# Altium schematic sheet 控制板.SchDoc
size A2; Author: Dolphi; DrawnBy: Dolphi; : 空调控制器继电器版; Revision: 4.0
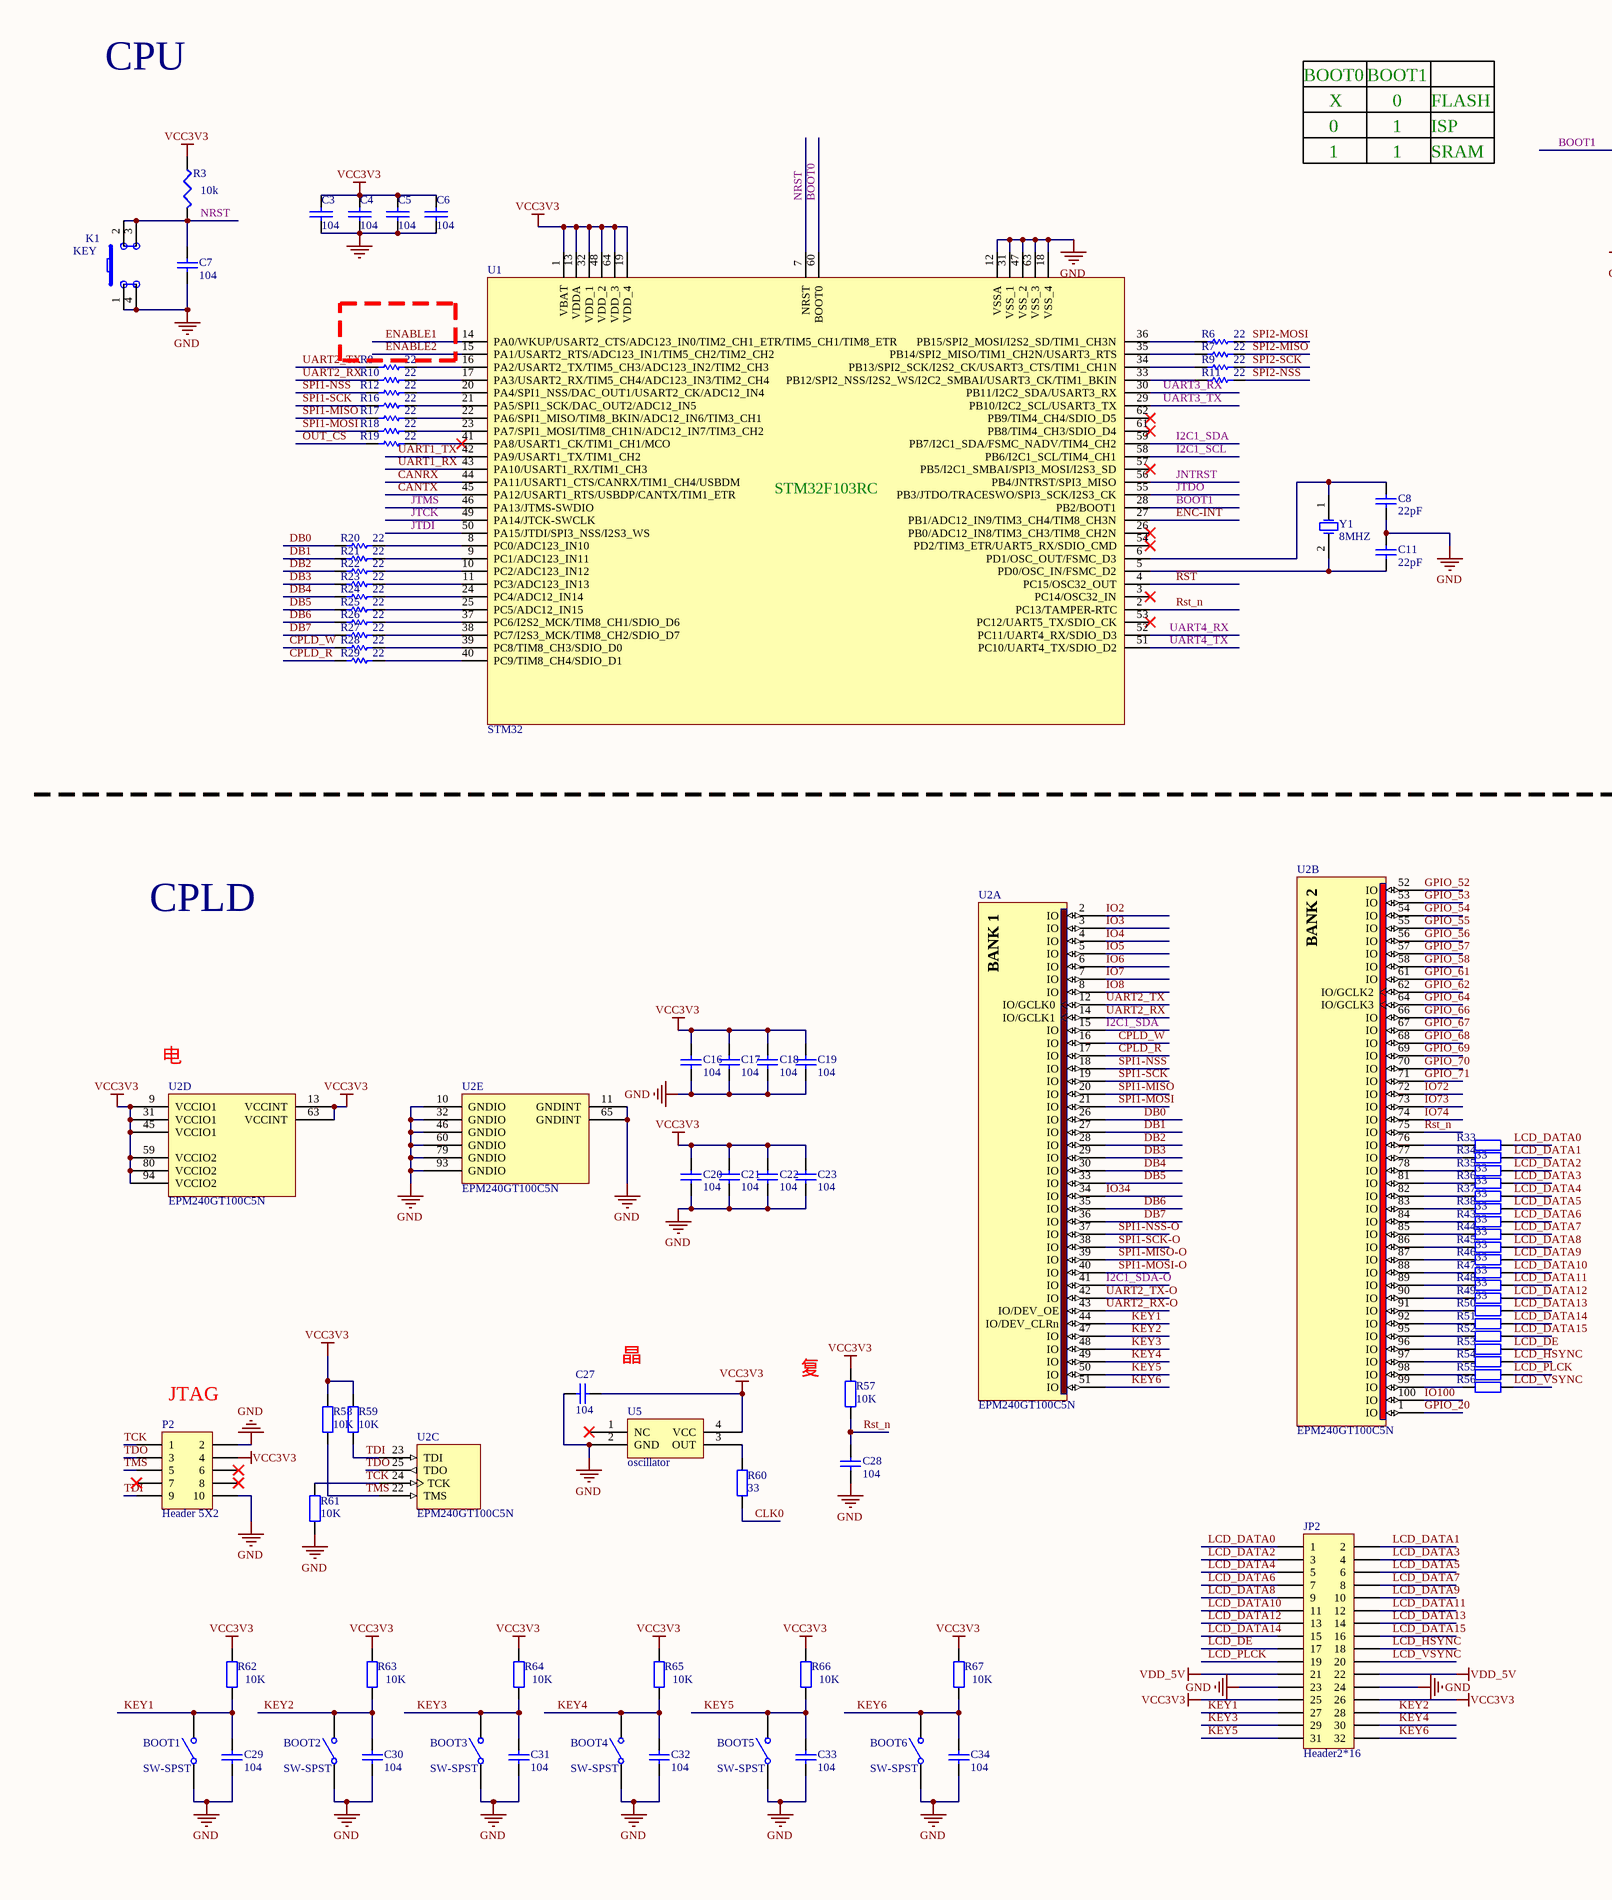
[diagram p0: 控制板.SchDoc, left]
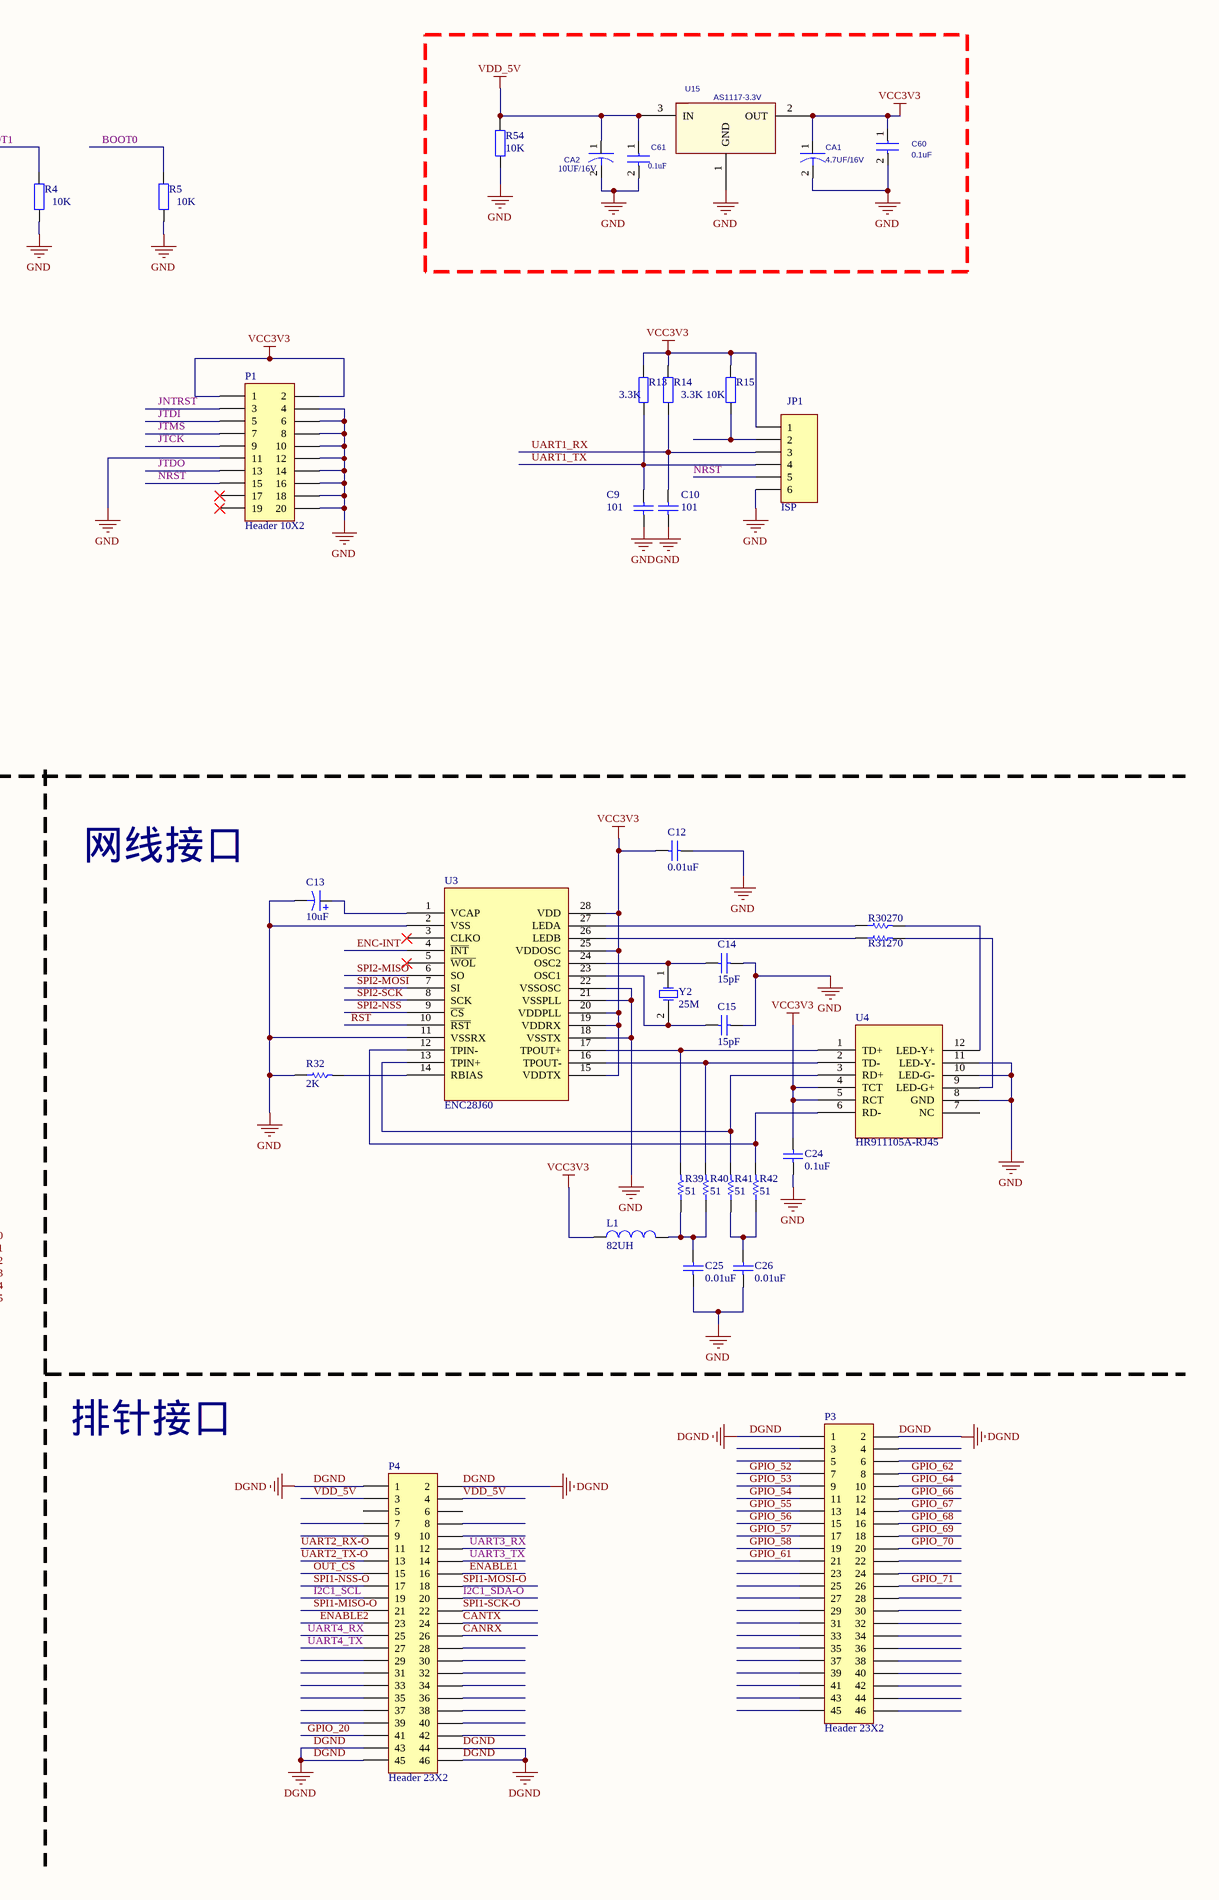
[diagram p1: 控制板.SchDoc, right]

## Parts
(Parts that share a designator on the sheet are numbered #1, #2 ... from top to bottom, then left to right.)
BOOT1  SW-SPST  [HEAD1*2]
BOOT2  SW-SPST  [HEAD1*2]
BOOT3  SW-SPST  [HEAD1*2]
BOOT4  SW-SPST  [HEAD1*2]
BOOT5  SW-SPST  [HEAD1*2]
BOOT6  SW-SPST  [HEAD1*2]
C3  104  [C0805]
C4  104  [C0805]
C5  104  [C0805]
C6  104  [C0805]
C7  104  [C0805]
C8  value 22pF  [C0805]  (hidden comment: Cap)
C9  101  [C0805]
C10  101  [C0805]
C11  value 22pF  [C0805]  (hidden comment: Cap)
C12  value 0.01uF  [C0805]  (hidden comment: Cap Semi)
C13  value 10uF  [1210C]  (hidden comment: Cap Pol3)
C14  value 15pF  [C0805]  (hidden comment: Cap Semi)
C15  value 15pF  [C0805]  (hidden comment: Cap Semi)
C16  value 104  [C0805]  (hidden comment: Cap)
C17  value 104  [C0805]  (hidden comment: Cap)
C18  value 104  [C0805]  (hidden comment: Cap)
C19  value 104  [C0805]  (hidden comment: Cap)
C20  value 104  [C0805]  (hidden comment: Cap)
C21  value 104  [C0805]  (hidden comment: Cap)
C22  value 104  [C0805]  (hidden comment: Cap)
C23  value 104  [C0805]  (hidden comment: Cap)
C24  value 0.1uF  [C0805]  (hidden comment: Cap Semi)
C25  value 0.01uF  [C0805]  (hidden comment: Cap Semi)
C26  value 0.01uF  [C0805]  (hidden comment: Cap Semi)
C27  value 104  [C0805]  (hidden comment: Cap)
C28  value 104  [C0805]  (hidden comment: Cap)
C29  104  [C0805]
C30  104  [C0805]
C31  104  [C0805]
C32  104  [C0805]
C33  104  [C0805]
C34  104  [C0805]
C60  0.1uF  [0805_CAP]
C61  0.1uF  [0805_CAP]
CA1  4.7UF/16V  [3528cap]
CA2  10UF/16V  [3528cap]
JP1  ISP
JP2  Header2*16
K1  KEY  [KEY-DIP]
L1  value 82UH  [R0805]  (hidden comment: Inductor)
P1  Header 10X2  [IDC-20]
P2  Header 5X2  [HDR2X5]
P3  Header 23X2  [HDR2X23]
P4  Header 23X2  [HDR2X23]
R3  10k  [R0805]
R4  value 10K  [R0805]  (hidden comment: Res2)
R5  value 10K  [R0805]  (hidden comment: Res2)
R6  value 22  [R0805]  (hidden comment: Res Semi)
R7  value 22  [R0805]  (hidden comment: Res Semi)
R8  value 22  [R0805]  (hidden comment: Res Semi)
R9  value 22  [R0805]  (hidden comment: Res Semi)
R10  value 22  [R0805]  (hidden comment: Res Semi)
R11  value 22  [R0805]  (hidden comment: Res Semi)
R12  value 22  [R0805]  (hidden comment: Res Semi)
R13  value 3.3K  [R0805]  (hidden comment: Res2)
R14  value 3.3K  [R0805]  (hidden comment: Res2)
R15  value 10K  [R0805]  (hidden comment: Res2)
R16  value 22  [R0805]  (hidden comment: Res Semi)
R17  value 22  [R0805]  (hidden comment: Res Semi)
R18  value 22  [R0805]  (hidden comment: Res Semi)
R19  value 22  [R0805]  (hidden comment: Res Semi)
R20  value 22  [R0805]  (hidden comment: Res Semi)
R21  value 22  [R0805]  (hidden comment: Res Semi)
R22  value 22  [R0805]  (hidden comment: Res Semi)
R23  value 22  [R0805]  (hidden comment: Res Semi)
R24  value 22  [R0805]  (hidden comment: Res Semi)
R25  value 22  [R0805]  (hidden comment: Res Semi)
R26  value 22  [R0805]  (hidden comment: Res Semi)
R27  value 22  [R0805]  (hidden comment: Res Semi)
R28  value 22  [R0805]  (hidden comment: Res Semi)
R29  value 22  [R0805]  (hidden comment: Res Semi)
R30  value 270  [R0805]  (hidden comment: Res Semi)
R31  value 270  [R0805]  (hidden comment: Res Semi)
R32  value 2K  [R0805]  (hidden comment: Res Semi)
R33  value 33  [R0805]  (hidden comment: Res2)
R34  value 33  [R0805]  (hidden comment: Res2)
R35  value 33  [R0805]  (hidden comment: Res2)
R36  value 33  [R0805]  (hidden comment: Res2)
R37  value 33  [R0805]  (hidden comment: Res2)
R38  value 33  [R0805]  (hidden comment: Res2)
R39  value 51  [R0805]  (hidden comment: Res Semi)
R40  value 51  [R0805]  (hidden comment: Res Semi)
R41  value 51  [R0805]  (hidden comment: Res Semi)
R42  value 51  [R0805]  (hidden comment: Res Semi)
R43  value 33  [R0805]  (hidden comment: Res2)
R44  value 33  [R0805]  (hidden comment: Res2)
R45  value 33  [R0805]  (hidden comment: Res2)
R46  value 33  [R0805]  (hidden comment: Res2)
R47  value 33  [R0805]  (hidden comment: Res2)
R48  value 33  [R0805]  (hidden comment: Res2)
R49  Res2  [R0805]  (value not drawn)
R50  Res2  [R0805]  (value not drawn)
R51  Res2  [R0805]  (value not drawn)
R52  Res2  [R0805]  (value not drawn)
R53  Res2  [R0805]  (value not drawn)
R54#1  10K  [0805]
R54#2  Res2  [R0805]  (value not drawn)
R55  Res2  [R0805]  (value not drawn)
R56  Res2  [R0805]  (value not drawn)
R57  value 10K  [R0805]  (hidden comment: Res2)
R58  value 10K  [R0805]  (hidden comment: Res2)
R59  value 10K  [R0805]  (hidden comment: Res2)
R60  value 33  [R0805]  (hidden comment: Res2)
R61  value 10K  [R0805]  (hidden comment: Res2)
R62  value 10K  [R0805]  (hidden comment: Res2)
R63  value 10K  [R0805]  (hidden comment: Res2)
R64  value 10K  [R0805]  (hidden comment: Res2)
R65  value 10K  [R0805]  (hidden comment: Res2)
R66  value 10K  [R0805]  (hidden comment: Res2)
R67  value 10K  [R0805]  (hidden comment: Res2)
U1  STM32  [LQFP64]
U2  EPM240GT100C5N  [TQFP100_N]  (parts A,B,C,D,E of 5)
U3  ENC28J60  [ENC28J60-ss]
U4  HR911105A-RJ45  [HR911105A]
U5  oscillator  [JZ]
U15  AS1117-3.3V  [SOT-223]
Y1  8MHZ  [XTAL]
Y2  25M  [xtal]

## Nets
DGND: P3.1 P3.2 P4.1 P4.2 P4.43 P4.44 P4.45 P4.46
GND: BOOT1.1(COMMON) BOOT2.1(COMMON) BOOT3.1(COMMON) BOOT4.1(COMMON) BOOT5.1(COMMON) BOOT6.1(COMMON) C3.2 C4.2 C5.2 C6.2 C7.1 C8.2 C9.1 C10.1 C11.1 C12.2 C13.2 C14.2 C15.2 C16.1 C17.1 C18.1 C19.1 C20.1 C21.1 C22.1 C23.1 C24.2 C25.1 C26.1 C27.1 C28.1 C29.1 C30.1 C31.1 C32.1 C33.1 C34.1 C60.2 C61.2 CA1.2 CA2.2 JP1.6 JP2.23 JP2.24 K1.1 K1.4 P1.4 P1.6 P1.8 P1.10 P1.11 P1.12 P1.14 P1.16 P1.18 P1.20 P2.2 P2.10 R4.1 R5.1 R32.1 R54#1.1 R61.1 U1.12(VSSA) U1.18(VSS_4) U1.31(VSS_1) U1.47(VSS_2) U1.63(VSS_3) U2.10(GNDIO) U2.11(GNDINT) U2.32(GNDIO) U2.46(GNDIO) U2.60(GNDIO) U2.65(GNDINT) U2.79(GNDIO) U2.93(GNDIO) U3.2(VSS) U3.11(VSSRX) U3.18(VSSTX) U3.21(VSSPLL) U3.22(VSSOSC) U4.8(GND) U4.10(LED-G-) U4.11(LED-Y-) U5.2(GND) U15.1(GND)
VCC3V3: C3.1 C4.1 C5.1 C6.1 C12.1 C16.2 C17.2 C18.2 C19.2 C20.2 C21.2 C22.2 C23.2 C24.1 C27.2 C60.1 CA1.1 JP1.1 JP2.25 JP2.26 L1.1 P1.1 P1.2 P2.4 R3.1 R13.2 R14.2 R15.2 R57.2 R58.2 R59.2 R62.2 R63.2 R64.2 R65.2 R66.2 R67.2 U1.1(VBAT) U1.13(VDDA) U1.19(VDD_4) U1.32(VDD_1) U1.48(VDD_2) U1.64(VDD_3) U2.9(VCCIO1) U2.13(VCCINT) U2.31(VCCIO1) U2.45(VCCIO1) U2.59(VCCIO2) U2.63(VCCINT) U2.80(VCCIO2) U2.94(VCCIO2) U3.15(VDDTX) U3.19(VDDRX) U3.20(VDDPLL) U3.25(VDDOSC) U3.28(VDD) U4.4(TCT) U4.5(RCT) U5.4(VCC) U15.2(OUT)
VDD_5V: C61.1 CA2.1 JP2.21 JP2.22 P4.3 P4.4 R54#1.2 U15.3(IN)
BOOT0: R5.2 U1.60(BOOT0)
BOOT1: R4.2 U1.28(PB2/BOOT1)
CANRX: P4.26 U1.44(PA11/USART1_CTS/CANRX/TIM1_CH4/USBDM)
CANTX: P4.24 U1.45(PA12/USART1_RTS/USBDP/CANTX/TIM1_ETR)
CLK0: R60.1
CPLD_R: R29.1 U2.17(IO)
CPLD_W: R28.1 U2.16(IO)
DB0: R20.1 U2.26(IO)
DB1: R21.1 U2.27(IO)
DB2: R22.1 U2.28(IO)
DB3: R23.1 U2.29(IO)
DB4: R24.1 U2.30(IO)
DB5: R25.1 U2.33(IO)
DB6: R26.1 U2.35(IO)
DB7: R27.1 U2.36(IO)
ENABLE1: P4.16 U1.14(PA0/WKUP/USART2_CTS/ADC123_IN0/TIM2_CH1_ETR/TIM5_CH1/TIM8_ETR)
ENABLE2: P4.23 U1.15(PA1/USART2_RTS/ADC123_IN1/TIM5_CH2/TIM2_CH2)
ENC-INT: U1.27(PB1/ADC12_IN9/TIM3_CH4/TIM8_CH3N) U3.4(~{INT})
GPIO_20: P4.41 U2.1(IO)
GPIO_52: P3.7 U2.52(IO)
GPIO_53: P3.9 U2.53(IO)
GPIO_54: P3.11 U2.54(IO)
GPIO_55: P3.13 U2.55(IO)
GPIO_56: P3.15 U2.56(IO)
GPIO_57: P3.17 U2.57(IO)
GPIO_58: P3.19 U2.58(IO)
GPIO_61: P3.21 U2.61(IO)
GPIO_62: P3.8 U2.62(IO/GCLK2)
GPIO_64: P3.10 U2.64(IO/GCLK3)
GPIO_66: P3.12 U2.66(IO)
GPIO_67: P3.14 U2.67(IO)
GPIO_68: P3.16 U2.68(IO)
GPIO_69: P3.18 U2.69(IO)
GPIO_70: P3.20 U2.70(IO)
GPIO_71: P3.26 U2.71(IO)
I2C1_SCL: P4.19 U1.58(PB6/I2C1_SCL/TIM4_CH1)
I2C1_SDA: U1.59(PB7/I2C1_SDA/FSMC_NADV/TIM4_CH2) U2.15(IO)
I2C1_SDA-O: P4.20 U2.41(IO)
IO2: U2.2(IO)
IO3: U2.3(IO)
IO4: U2.4(IO)
IO5: U2.5(IO)
IO6: U2.6(IO)
IO7: U2.7(IO)
IO8: U2.8(IO)
IO34: U2.34(IO)
IO72: U2.72(IO)
IO73: U2.73(IO)
IO74: U2.74(IO)
IO100: U2.100(IO)
JNTRST: P1.3 U1.56(PB4/JNTRST/SPI3_MISO)
JTCK: P1.9 U1.49(PA14/JTCK-SWCLK)
JTDI: P1.5 U1.50(PA15/JTDI/SPI3_NSS/I2S3_WS)
JTDO: P1.13 U1.55(PB3/JTDO/TRACESWO/SPI3_SCK/I2S3_CK)
JTMS: P1.7 U1.46(PA13/JTMS-SWDIO)
KEY1: BOOT1.2(NO) C29.2 JP2.27 R62.1 U2.44(IO/DEV_CLRn)
KEY2: BOOT2.2(NO) C30.2 JP2.28 R63.1 U2.47(IO)
KEY3: BOOT3.2(NO) C31.2 JP2.29 R64.1 U2.48(IO)
KEY4: BOOT4.2(NO) C32.2 JP2.30 R65.1 U2.49(IO)
KEY5: BOOT5.2(NO) C33.2 JP2.31 R66.1 U2.50(IO)
KEY6: BOOT6.2(NO) C34.2 JP2.32 R67.1 U2.51(IO)
LCD_DATA0: JP2.1 R33.1
LCD_DATA1: JP2.2 R34.1
LCD_DATA2: JP2.3 R35.1
LCD_DATA3: JP2.4 R36.1
LCD_DATA4: JP2.5 R37.1
LCD_DATA5: JP2.6 R38.1
LCD_DATA6: JP2.7 R43.1
LCD_DATA7: JP2.8 R44.1
LCD_DATA8: JP2.9 R45.1
LCD_DATA9: JP2.10 R46.1
LCD_DATA10: JP2.11 R47.1
LCD_DATA11: JP2.12 R48.1
LCD_DATA12: JP2.13 R49.1
LCD_DATA13: JP2.14 R50.1
LCD_DATA14: JP2.15 R51.1
LCD_DATA15: JP2.16 R52.1
LCD_DE: JP2.17 R53.1
LCD_HSYNC: JP2.18 R54#2.1
LCD_PLCK: JP2.19 R55.1
LCD_VSYNC: JP2.20 R56.1
NRST: C7.2 JP1.5 K1.2 K1.3 P1.15 R3.2 U1.7(NRST)
OUT_~{CS}: P4.15 R19.1
~{RST}: U1.4(PC15/OSC32_OUT) U3.10(~{RST})
Rst_n: C28.2 R57.1 U1.2(PC13/TAMPER-RTC) U2.75(IO)
SPI1-MISO: R17.1 U2.20(IO)
SPI1-MISO-O: P4.21 U2.39(IO)
SPI1-MOSI: R18.1 U2.21(IO)
SPI1-MOSI-O: P4.18 U2.40(IO)
SPI1-NSS: R12.1 U2.18(IO)
SPI1-NSS-O: P4.17 U2.37(IO)
SPI1-SCK: R16.1 U2.19(IO)
SPI1-SCK-O: P4.22 U2.38(IO)
SPI2-MISO: R7.2 U3.6(SO)
SPI2-MOSI: R6.2 U3.7(SI)
SPI2-NSS: R11.2 U3.9(~{CS})
SPI2-SCK: R9.2 U3.8(SCK)
TCK: P2.1 R61.2 U2.24(TCK)
TDI: P2.9 R59.1 U2.23(TDI)
TDO: P2.3 U2.25(TDO)
TMS: P2.5 R58.1 U2.22(TMS)
UART1_RX: C10.2 JP1.3 R14.1 U1.43(PA10/USART1_RX/TIM1_CH3)
UART1_TX: C9.2 JP1.4 R13.1 U1.42(PA9/USART1_TX/TIM1_CH2)
UART2_RX: R10.1 U2.14(IO/GCLK1)
UART2_RX-O: P4.11 U2.43(IO/DEV_OE)
UART2_TX: R8.1 U2.12(IO/GCLK0)
UART2_TX-O: P4.13 U2.42(IO)
UART3_RX: P4.12 U1.30(PB11/I2C2_SDA/USART3_RX)
UART3_TX: P4.14 U1.29(PB10/I2C2_SCL/USART3_TX)
UART4_RX: P4.25 U1.52(PC11/UART4_RX/SDIO_D3)
UART4_TX: P4.27 U1.51(PC10/UART4_TX/SDIO_D2)
NetC8_1: C8.1 U1.6(PD1/OSC_OUT/FSMC_D3) Y1.1(OSC1)
NetC11_2: C11.2 U1.5(PD0/OSC_IN/FSMC_D2) Y1.2(OSC2)
NetC13_1: C13.1 U3.1(VCAP)
NetC14_1: C14.1 U3.24(OSC2) Y2.1(OSC1)
NetC15_1: C15.1 U3.23(OSC1) Y2.2(OSC2)
NetC25_2: C25.2 L1.2 R39.1 R40.1
NetC26_2: C26.2 R41.1 R42.1
NetJP1_2: JP1.2 R15.1
NetR6_1: R6.1 U1.36(PB15/SPI2_MOSI/I2S2_SD/TIM1_CH3N)
NetR7_1: R7.1 U1.35(PB14/SPI2_MISO/TIM1_CH2N/USART3_RTS)
NetR8_2: R8.2 U1.16(PA2/USART2_TX/TIM5_CH3/ADC123_IN2/TIM2_CH3)
NetR9_1: R9.1 U1.34(PB13/SPI2_SCK/I2S2_CK/USART3_CTS/TIM1_CH1N)
NetR10_2: R10.2 U1.17(PA3/USART2_RX/TIM5_CH4/ADC123_IN3/TIM2_CH4)
NetR11_1: R11.1 U1.33(PB12/SPI2_NSS/I2S2_WS/I2C2_SMBAI/USART3_CK/TIM1_BKIN)
NetR12_2: R12.2 U1.20(PA4/SPI1_NSS/DAC_OUT1/USART2_CK/ADC12_IN4)
NetR16_2: R16.2 U1.21(PA5/SPI1_SCK/DAC_OUT2/ADC12_IN5)
NetR17_2: R17.2 U1.22(PA6/SPI1_MISO/TIM8_BKIN/ADC12_IN6/TIM3_CH1)
NetR18_2: R18.2 U1.23(PA7/SPI1_MOSI/TIM8_CH1N/ADC12_IN7/TIM3_CH2)
NetR19_2: R19.2 U1.41(PA8/USART1_CK/TIM1_CH1/MCO)
NetR20_2: R20.2 U1.8(PC0/ADC123_IN10)
NetR21_2: R21.2 U1.9(PC1/ADC123_IN11)
NetR22_2: R22.2 U1.10(PC2/ADC123_IN12)
NetR23_2: R23.2 U1.11(PC3/ADC123_IN13)
NetR24_2: R24.2 U1.24(PC4/ADC12_IN14)
NetR25_2: R25.2 U1.25(PC5/ADC12_IN15)
NetR26_2: R26.2 U1.37(PC6/I2S2_MCK/TIM8_CH1/SDIO_D6)
NetR27_2: R27.2 U1.38(PC7/I2S3_MCK/TIM8_CH2/SDIO_D7)
NetR28_2: R28.2 U1.39(PC8/TIM8_CH3/SDIO_D0)
NetR29_2: R29.2 U1.40(PC9/TIM8_CH4/SDIO_D1)
NetR30_1: R30.1 U3.27(LEDA)
NetR30_2: R30.2 U4.12(LED-Y+)
NetR31_1: R31.1 U3.26(LEDB)
NetR31_2: R31.2 U4.9(LED-G+)
NetR32_2: R32.2 U3.14(RBIAS)
NetR33_2: R33.2 U2.76(IO)
NetR34_2: R34.2 U2.77(IO)
NetR35_2: R35.2 U2.78(IO)
NetR36_2: R36.2 U2.81(IO)
NetR37_2: R37.2 U2.82(IO)
NetR38_2: R38.2 U2.83(IO)
NetR39_2: R39.2 U3.17(TPOUT+) U4.1(TD+)
NetR40_2: R40.2 U3.16(TPOUT-) U4.2(TD-)
NetR41_2: R41.2 U3.13(TPIN+) U4.3(RD+)
NetR42_2: R42.2 U3.12(TPIN-) U4.6(RD-)
NetR43_2: R43.2 U2.84(IO)
NetR44_2: R44.2 U2.85(IO)
NetR45_2: R45.2 U2.86(IO)
NetR46_2: R46.2 U2.87(IO)
NetR47_2: R47.2 U2.88(IO)
NetR48_2: R48.2 U2.89(IO)
NetR49_2: R49.2 U2.90(IO)
NetR50_2: R50.2 U2.91(IO)
NetR51_2: R51.2 U2.92(IO)
NetR52_2: R52.2 U2.95(IO)
NetR53_2: R53.2 U2.96(IO)
NetR54#2_2: R54#2.2 U2.97(IO)
NetR55_2: R55.2 U2.98(IO)
NetR56_2: R56.2 U2.99(IO)
NetR60_2: R60.2 U5.3(OUT)

Not connected (* = marked no-connect by the designer): P1 17* 19*; P2 6* 7* 8*; P3 3 4 5 6 22 23 24 25 27 28 29 30 31 32 33 34 35 36 37 38 39 40 41 42 43 44 45 46; P4 5 6 7 8 9 10 28 29 30 31 32 33 34 35 36 37 38 39 40 42; U1 3(PC14/OSC32_IN)* 26(PB0/ADC12_IN8/TIM3_CH3/TIM8_CH2N)* 53(PC12/UART5_TX/SDIO_CK)* 54(PD2/TIM3_ETR/UART5_RX/SDIO_CMD)* 57(PB5/I2C1_SMBAI/SPI3_MOSI/I2S3_SD)* 61(PB8/TIM4_CH3/SDIO_D4)* 62(PB9/TIM4_CH4/SDIO_D5)*; U3 3(CLKO)* 5(~{WOL})*; U4 7(NC); U5 1(NC)*

## Notes on the sheet
- CPU
- BOOT0
- X
- 0
- BOOT1
- 1
- FLASH
- ISP
- SRAM
- 网线接口
- CPLD
- (near U2) 电
- (near P2) JTAG
- 晶
- (near R57) 复
- 排针接口
- (in symbol EPM240GT100C5N, part A) BANK 1
- (in symbol EPM240GT100C5N, part B) BANK 2
- (in symbol STM32F103RE) STM32F103RC

## Library data of the parts
BOOT1-BOOT6 = SW-SPST: Single-Pole, Single-Throw Switch; Published: 24-Mar-1999; LatestRevisionDate: 17-Jul-2002; LatestRevisionNote: Re-released for DXP Platform.; PackageReference: SPST-2; Publisher: Altium Limited
C3-C6 = CAP: Capacitor
C7 C9 C10 C29-C34 = Cap: Capacitor; Value: 100pF; Published: 8-Jun-2000; LatestRevisionDate: 17-Jul-2002; LatestRevisionNote: Re-released for DXP Platform.; Publisher: Altium Limited
C8 C11 C16-C23 C27 C28 = Cap: Capacitor; Published: 8-Jun-2000; LatestRevisionDate: 17-Jul-2002; LatestRevisionNote: Re-released for DXP Platform.; PackageReference: RAD-0.3; Publisher: Altium Limited
C12 C14 C15 C24-C26 = Cap Semi: Capacitor (Semiconductor SIM Model); Published: 8-Jun-2000; LatestRevisionDate: 29-May-2009; LatestRevisionNote: IPC-7351 Footprint Added.; PackageReference: C1206; Publisher: Altium Limited; PackageDescription: Chip Capacitor
C13 = Cap Pol3: Polarized Capacitor (Surface Mount); Published: 8-Jun-2000; LatestRevisionDate: 29-May-2009; LatestRevisionNote: IPC-7351 Footprint Added.; PackageReference: C0805; Publisher: Altium Limited; PackageDescription: Chip Capacitor
C60 C61 = C
CA1 CA2 = ECAP
JP1 = Header1*6
L1 = Inductor: Code_IEC: 1005; Published: 8-Jun-2000; LatestRevisionDate: 29-May-2009; LatestRevisionNote: IPC-7351 Footprint Added.; PackageReference: 0402-A; Publisher: Altium Limited; PackageDescription: Chip Inductor; Code_JEITA: 0402
P1 = Header 10X2: Header, 10-Pin, Dual row; LatestRevisionDate: 17-Jul-2002; LatestRevisionNote: Re-released for DXP Platform.; Publisher: Altium Limited
P2 = Header 5X2: Header, 5-Pin, Dual row; LatestRevisionDate: 17-Jul-2002; LatestRevisionNote: Re-released for DXP Platform.; Publisher: Altium Limited
P3 P4 = Header 23X2: Header, 23-Pin, Dual row; LatestRevisionDate: 17-Jul-2002; LatestRevisionNote: Re-released for DXP Platform.; Publisher: Altium Limited
R3 = Res3: Resistor; Value: 1K; Published: 8-Jun-2000; LatestRevisionDate: 17-Jul-2002; LatestRevisionNote: Re-released for DXP Platform.; Publisher: Altium Limited
R4 R5 R13-R15 R33-R38 R43-R53 R54#2 R55-R67 = Res2: Resistor; Published: 8-Jun-2000; LatestRevisionDate: 17-Jul-2002; LatestRevisionNote: Re-released for DXP Platform.; PackageReference: AXIAL-0.4; Publisher: Altium Limited
R6-R12 R16-R32 R39-R42 = Res Semi: Semiconductor Resistor; Published: 8-Jun-2000; LatestRevisionDate: 17-Jul-2002; LatestRevisionNote: Re-released for DXP Platform.; PackageReference: AXIAL-0.5; Publisher: Altium Limited
R54#1 = Res2: Resistor; Value: 100K; Published: 8-Jun-2000; LatestRevisionDate: 17-Jul-2002; LatestRevisionNote: Re-released for DXP Platform.; PackageReference: AXIAL-0.4; Publisher: Altium Limited; PackageDescription: Axial Device, Thru-Hole; 2 Leads; 0.4 in Pin Spacing
U1 = STM32F103RE
U2 = EPM240GT100C5N: MAX II 1.8V CPLD, 80 IOs, 240 Logic Elements, 100-Pin Plastic TQFP, Commercial Temperature, Speed Grade 5, Pb-Free; Note: Each set of VCCIO pins can be connected to 3.3V, 2.5V, 1.8V, or 1.5V.; Note: All VCCINT pins must be connected to 1.8V.; Published: 4-Mar-2005; LatestRevisionDate: 13-Apr-2006; LatestRevisionNote: IPC-7351 Footprint Added.; DatasheetVersion: ver1.8, Jul-2006; PackageVersion: ver14.3, Jul-2006; PackageReference: TQFP100; Publisher: Altium Limited; PackageDescription: 100-Pin Plastic Thin Quad Flat Pack (TQFP100); Code_JEDEC: MS-026-AED; ComponentLink1Description: Manufacturer Link; ComponentLink1URL: http://www.altera.com/products/devices/cpld/max2/mx2-index.jsp; ComponentLink2Description: Handbook; ComponentLink2URL: http://www.altera.com/literature/hb/max2/max2_mii5v1.pdf; ComponentLink3Description: Packaging Specification; ComponentLink3URL: http://www.altera.com/literature/ds/dspkg.pdf
U15 = AS1117
Y1 Y2 = XTAL: Crystal Oscillator; Published: 8-Jun-2000; LatestRevisionDate: 17-Jul-2002; LatestRevisionNote: Re-released for DXP Platform.; PackageReference: R38; Publisher: Altium Limited